# EAGLE design draft2 (EAGLE 6.2)
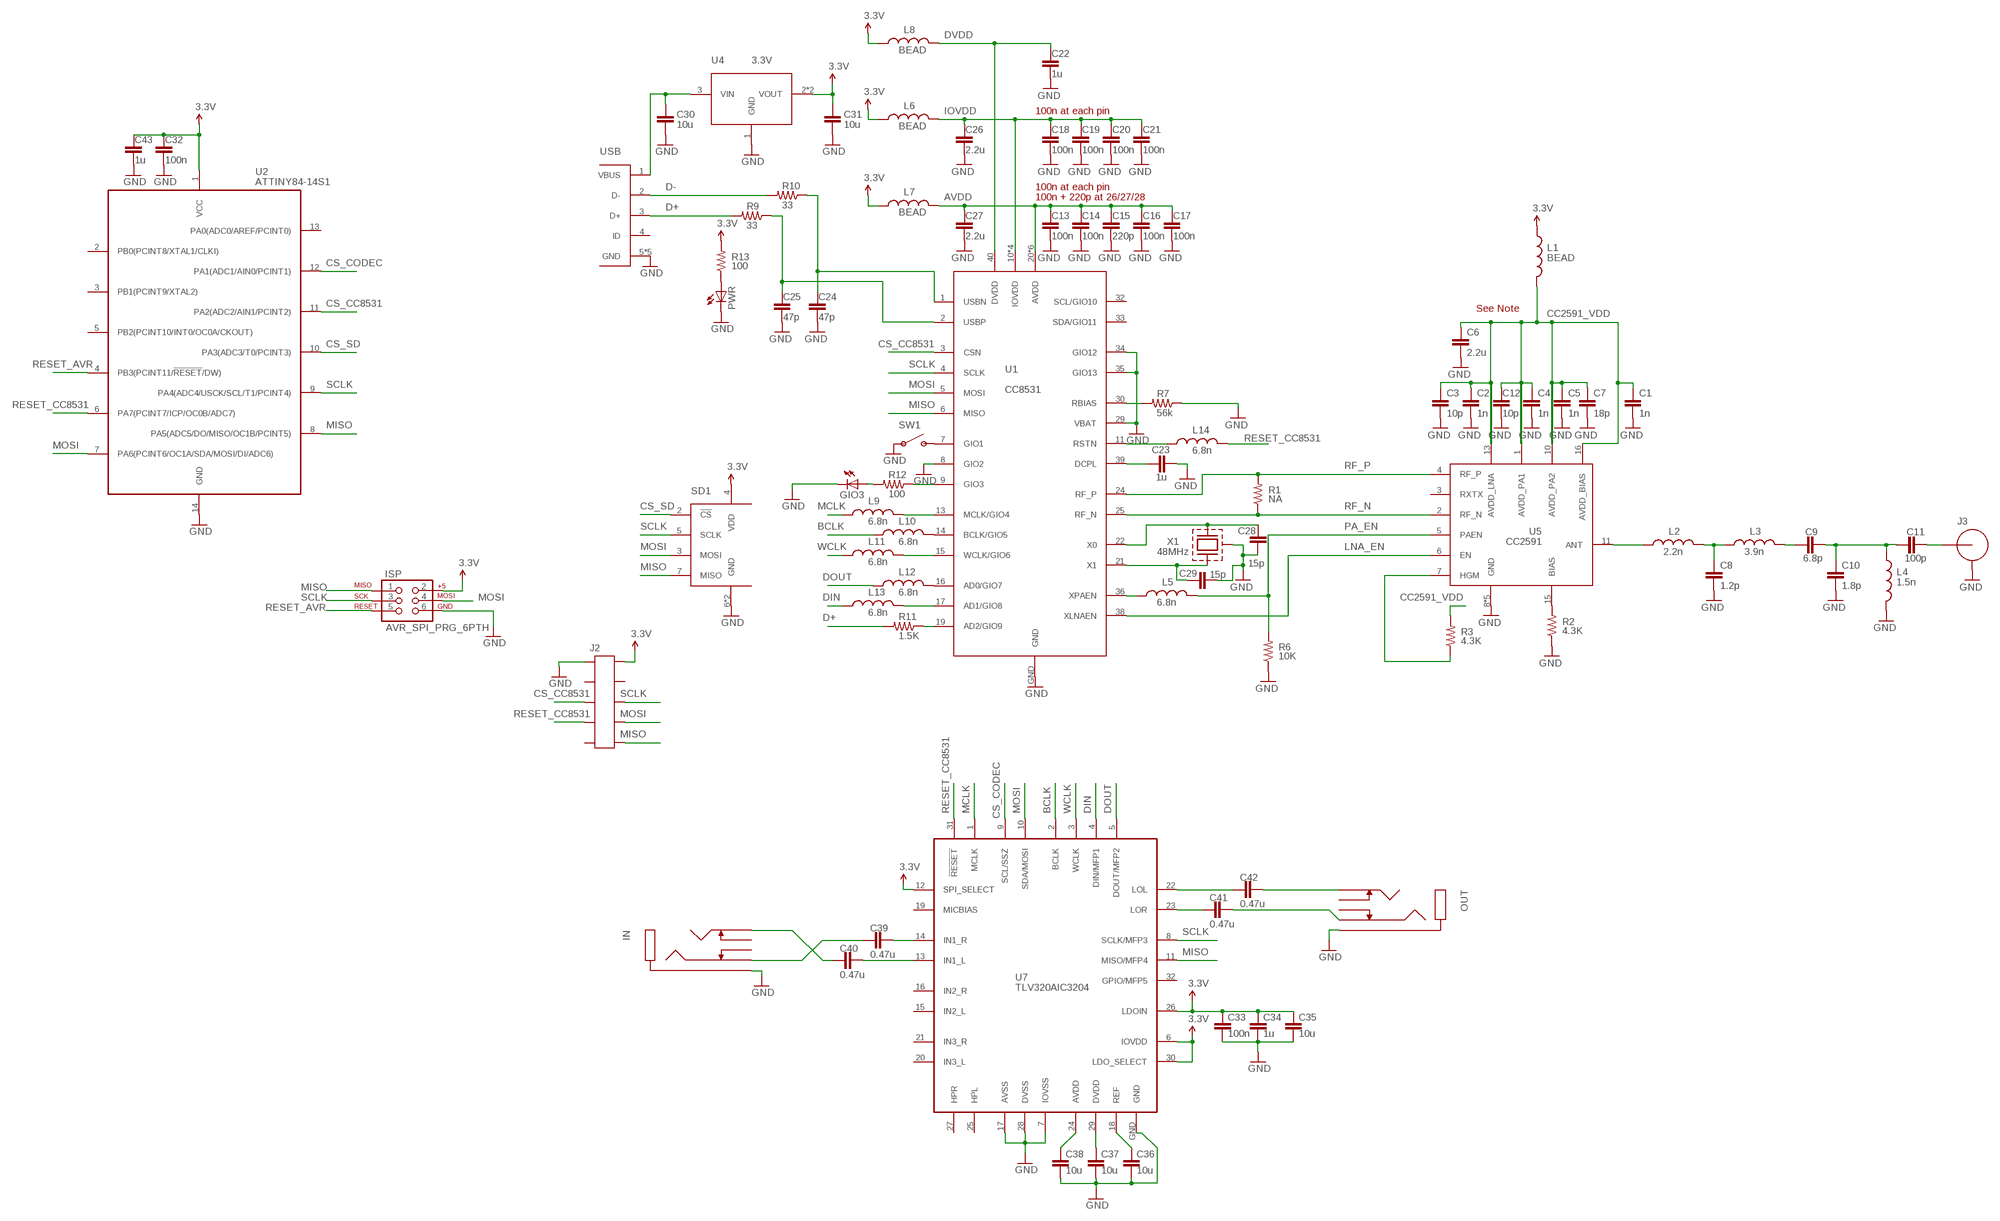
[diagram p0: schematic, sheet 1]

## Parts
C1  1n  C-EUC0603  [C0603]
C2  1n  C-EUC0603  [C0603]
C3  10p  C-EUC0603  [C0603]
C4  1n  C-EUC0603  [C0603]
C5  1n  C-EUC0603  [C0603]
C6  2.2u  C-EUC0603  [C0603]
C7  18p  C-EUC0603  [C0603]
C8  1.2p  C-EUC0603  [C0603]
C9  6.8p  C-EUC0603  [C0603]
C10  1.8p  C-EUC0603  [C0603]
C11  100p  C-EUC0603  [C0603]
C12  10p  C-EUC0603  [C0603]
C13  100n  C-EUC0603  [C0603]
C14  100n  C-EUC0603  [C0603]
C15  220p  C-EUC0603  [C0603]
C16  100n  C-EUC0603  [C0603]
C17  100n  C-EUC0603  [C0603]
C18  100n  C-EUC0603  [C0603]
C19  100n  C-EUC0603  [C0603]
C20  100n  C-EUC0603  [C0603]
C21  100n  C-EUC0603  [C0603]
C22  1u  C-EUC0603  [C0603]
C23  1u  C-EUC0603  [C0603]
C24  47p  C-EUC0603  [C0603]
C25  47p  C-EUC0603  [C0603]
C26  2.2u  C-EUC0603  [C0603]
C27  2.2u  C-EUC0603  [C0603]
C28  15p  C-EUC0603  [C0603]
C29  15p  C-EUC0603  [C0603]
C30  10u  C-EUC0603  [C0603]
C31  10u  C-EUC0603  [C0603]
C32  100n  C-EUC0603  [C0603]
C33  100n  C-EUC0603  [C0603]
C34  1u  C-EUC0603  [C0603]
C35  10u  C-EUC0603  [C0603]
C36  10u  C-EUC0603  [C0603]
C37  10u  C-EUC0603  [C0603]
C38  10u  C-EUC0603  [C0603]
C39  0.47u  C-EUC0603  [C0603]
C40  0.47u  C-EUC0603  [C0603]
C41  0.47u  C-EUC0603  [C0603]
C42  0.47u  C-EUC0603  [C0603]
C43  1u  C-EUC0603  [C0603]
GIO3  LEDCHIP-LED0603  [CHIP-LED0603]
IN  PHONE_SW  [35RAPC4BV4]
ISP  AVR_SPI_PRG_6PTH  [2X3]
J2  HEADER-10P-SMD-MALE  [10P-0.05-HEADER]
J3  SMA  [CONSMA003.031]
L1  BEAD  INDUCTOR0603  [0603]
L2  2.2n  INDUCTOR0603  [0603]
L3  3.9n  INDUCTOR0603  [0603]
L4  1.5n  INDUCTOR0603  [0603]
L5  6.8n  INDUCTOR0603  [0603]
L6  BEAD  INDUCTOR0603  [0603]
L7  BEAD  INDUCTOR0603  [0603]
L8  BEAD  INDUCTOR0603  [0603]
L9  6.8n  INDUCTOR0603  [0603]
L10  6.8n  INDUCTOR0603  [0603]
L11  6.8n  INDUCTOR0603  [0603]
L12  6.8n  INDUCTOR0603  [0603]
L13  6.8n  INDUCTOR0603  [0603]
L14  6.8n  INDUCTOR0603  [0603]
OUT  PHONE_SW  [35RAPC4BV4]
PWR  LEDCHIP-LED0603  [CHIP-LED0603]
R1  NA  R-US_R0603  [R0603]
R2  4.3K  R-US_R0603  [R0603]
R3  4.3K  R-US_R0603  [R0603]
R6  10K  R-US_R0603  [R0603]
R7  56k  R-US_R0603  [R0603]
R9  33  R-US_R0603  [R0603]
R10  33  R-US_R0603  [R0603]
R11  1.5K  R-US_R0603  [R0603]
R12  100  R-US_R0603  [R0603]
R13  100  R-US_R0603  [R0603]
SD1  MICROSDDM3AT  [DM3AT]
SW1  SPST-SMD  [TACT_SW]
U1  CC8531  [S-PVQFN-N40]
U2  ATTINY84-14S1  [SOIC14]
U4  3.3V  NX1117C  [SOT-223]
U5  CC2591  [S-PVQFN-N16]
U7  TLV320AIC3204  [S-PVQFN-N32]
USB  USB_MICRO_AB  [USB_MICRO_AB]
X1  48MHz  XTAL-ABRACONABM3C  [ABM3C]

## Nets
3.3V: C31.1 C32.1 C33.1 C34.1 C35.1 C43.1 ISP.2 J2.2 L1.1 L6.1 L7.1 L8.1 R13.2 SD1.4(VDD) U2.1(VCC) U4.2(VOUT) U4.4(VOUT) U7.6(IOVDD) U7.12(SPI_SELECT) U7.26(LDOIN) U7.30(LDO_SELECT)
AVDD: C13.1 C14.1 C15.1 C16.1 C17.1 C27.1 L7.2 U1.20(AVDD) U1.23(AVDD) U1.26(AVDD) U1.27(AVDD) U1.28(AVDD) U1.31(AVDD)
BCLK: L10.1 U7.2(BCLK)
CC2591_VDD: C1.1 C2.1 C3.1 C4.1 C5.1 C6.1 C7.1 C12.1 L1.2 R3.2 U5.1(AVDD_PA1) U5.10(AVDD_PA2) U5.13(AVDD_LNA) U5.16(AVDD_BIAS)
CS_CC8531: J2.5 U1.3(CSN) U2.11(PA2(ADC2/AIN1/PCINT2))
CS_CODEC: U2.12(PA1(ADC1/AIN0/PCINT1)) U7.9(SCL/SSZ)
CS_SD: SD1.2(!CS) U2.10(PA3(ADC3/T0/PCINT3))
D+: R9.2 R11.2 USB.3(D+)
D-: R10.2 USB.2(D-)
DIN: L13.1 U7.4(DIN/MFP1)
DOUT: L12.1 U7.5(DOUT/MFP2)
DVDD: C22.1 L8.2 U1.40(DVDD)
GND: C1.2 C2.2 C3.2 C4.2 C5.2 C6.2 C7.2 C8.2 C10.2 C12.2 C13.2 C14.2 C15.2 C16.2 C17.2 C18.2 C19.2 C20.2 C21.2 C22.2 C23.2 C24.2 C25.2 C26.2 C27.2 C28.2 C29.2 C30.2 C31.2 C32.2 C33.2 C34.2 C35.2 C36.2 C37.2 C38.2 C43.2 GIO3.C IN.1(GND) ISP.6 J2.1 J3.GND1(GND) J3.GND2(GND) J3.GND3(GND) J3.GND4(GND) L4.2 OUT.1(GND) PWR.C R2.1 R6.1 R7.1 SD1.6(GND) SD1.GND SW1.1 SW1.2 U1.8(GIO2) U1.29(VBAT) U1.34(GIO12) U1.35(GIO13) U1.GND U2.14(GND) U4.1(GND) U5.8(GND) U5.9(GND) U5.12(GND) U5.14(GND) U5.GND U7.7(IOVSS) U7.17(AVSS) U7.28(DVSS) U7.GND USB.5(GND) USB.GND1(GND) USB.GND2(GND) USB.GND3(GND) USB.GND4(GND) X1.2(CASE) X1.4(CASE)
IOVDD: C18.1 C19.1 C20.1 C21.1 C26.1 L6.2 U1.10(IOVDD) U1.12(IOVDD) U1.18(IOVDD) U1.37(IOVDD)
IOVDD1: C24.1 R10.1 U1.1(USBN)
IOVDD2: C25.1 R9.1 U1.2(USBP)
LNA_EN: U1.38(XLNAEN) U5.6(EN)
MCLK: L9.1 U7.1(MCLK)
MISO: ISP.1 J2.10 SD1.7(MISO) U1.6(MISO) U2.8(PA5(ADC5/DO/MISO/OC1B/PCINT5)) U7.11(MISO/MFP4)
MOSI: ISP.4 J2.8 SD1.3(MOSI) U1.5(MOSI) U2.7(PA6(PCINT6/OC1A/SDA/MOSI/DI/ADC6)) U7.10(SDA/MOSI)
N$1: C29.1 U1.21(X1) X1.1
N$2: C28.1 U1.22(X0) X1.3
N$3: L14.1 U1.11(RSTN)
N$6: C30.1 U4.3(VIN) USB.1(VBUS)
N$7: R2.2 U5.15(BIAS)
N$8: R3.1 U5.7(HGM)
N$9: C11.2 J3.SIG
N$12: C38.1 U7.24(AVDD)
N$13: L2.1 U5.11(ANT)
N$14: C8.1 L2.2 L3.1
N$15: C9.1 L3.2
N$16: C9.2 C10.1 C11.1 L4.1
N$18: L5.1 U1.36(XPAEN)
N$19: R7.2 U1.30(RBIAS)
N$20: C36.1 U7.18(REF)
N$21: C23.1 U1.39(DCPL)
N$22: L10.2 U1.14(BCLK/GIO5)
N$23: L9.2 U1.13(MCLK/GIO4)
N$24: R11.1 U1.19(AD2/GIO9)
N$25: L11.2 U1.15(WCLK/GIO6)
N$26: L12.2 U1.16(AD0/GIO7)
N$27: L13.2 U1.17(AD1/GIO8)
N$28: R12.1 U1.9(GIO3)
N$29: GIO3.A R12.2
N$30: SW1.3 SW1.4 U1.7(GIO1)
N$31: PWR.A R13.1
N$32: C37.1 U7.29(DVDD)
N$33: C40.1 IN.2(L)
N$34: C39.2 U7.14(IN1_R)
N$35: C40.2 U7.13(IN1_L)
N$36: C39.1 IN.4(R)
N$37: C42.2 OUT.2(L)
N$38: C41.2 OUT.4(R)
N$39: C42.1 U7.22(LOL)
N$40: C41.1 U7.23(LOR)
PA_EN: L5.2 R6.2 U5.5(PAEN)
RESET_AVR: ISP.5 U2.4(PB3(PCINT11/!RESET!/DW))
RESET_CC8531: J2.7 L14.2 U2.6(PA7(PCINT7/ICP/OC0B/ADC7)) U7.31(!RESET)
RF_N: R1.1 U1.25(RF_N) U5.2(RF_N)
RF_P: R1.2 U1.24(RF_P) U5.4(RF_P)
SCLK: ISP.3 J2.6 SD1.5(SCLK) U1.4(SCLK) U2.9(PA4(ADC4/USCK/SCL/T1/PCINT4)) U7.8(SCLK/MFP3)
WCLK: L11.1 U7.3(WCLK)
Unconnected: IN.3(R_SW) IN.5(L_SW) J2.3 J2.4 J2.9 OUT.3(R_SW) OUT.5(L_SW) U1.32(SCL/GIO10) U1.33(SDA/GIO11) U2.2(PB0(PCINT8/XTAL1/CLKI)) U2.3(PB1(PCINT9/XTAL2)) U2.5(PB2(PCINT10/INT0/OC0A/CKOUT)) U2.13(PA0(ADC0/AREF/PCINT0)) U5.3(RXTX) U7.15(IN2_L) U7.16(IN2_R) U7.19(MICBIAS) U7.20(IN3_L) U7.21(IN3_R) U7.25(HPL) U7.27(HPR) U7.32(GPIO/MFP5) USB.4(ID)

## Notes on the sheet
- 100n at each pin
- 100n at each pin
- 100n + 220p at 26/27/28
- See Note

## Library data of the parts
C1-C43 = rcl:C-EU: CAPACITOR, European symbol
GIO3 PWR = led:LED: LED OSRAM: - CHIPLED LG R971, LG N971, LY N971, LG Q971, LY Q971, LO R971, LY R971 LH N974, LH R974 LS Q976, LO Q976, LY Q976 LO Q996 - Hyper CHIPLED LW Q18S LB Q993, LB Q99A, LB R99A - SideLED LS A670, LO A670, LY A670, LG A670, LP A670 LB A673, LV A673, LT A673, LW A673 LH A674 LY A675 LS A676, LA A676, LO A676, LY A676, LW A676 LS A679, LY A679, LG A679 - Hyper Micro SIDELED® LS Y876, LA Y876, LO Y876, LY Y876 LT Y87S - SmartLED LW L88C, LW L88S LB L89C, LB L89S, LG L890 LS L89K, LO L89K, LY L89K LS L896, LA L896, LO L896, LY L896 - TOPLED LS T670, LO T670, LY T670, LG T670, LP T670 LSG T670, LSP T670, LSY T670, LOP T670, LYG T670 LG T671, LOG T671, LSG T671 LB T673, LV T673, LT T673, LW T673 LH T674 LS T676, LA T676, LO T676, LY T676, LB T676, LH T676, LSB T676, LW T676 LB T67C, LV T67C, LT T67C, LS T67K, LO T67K, LY T67K, LW E67C LS E67B, LA E67B, LO E67B, LY E67B, LB E67C, LV E67C, LT E67C LW T67C LS T679, LY T679, LG T679 LS T770, LO T770, LY T770, LG T770, LP T770 LB T773, LV T773, LT T773, LW T773 LH T774 LS E675, LA E675, LY E675, LS T675 LS T776, LA T776, LO T776, LY T776, LB T776 LHGB T686 LT T68C, LB T68C - Hyper Mini TOPLED® LB M676 - Mini TOPLED Santana® LG M470 LS M47K, LO M47K, LY M47K Source: http://www.osram.convergy.de LUXEON: - LUMILED® LXK2-PW12-R00, LXK2-PW12-S00, LXK2-PW14-U00, LXK2-PW14-V00 LXK2-PM12-R00, LXK2-PM12-S00, LXK2-PM14-U00 LXK2-PE12-Q00, LXK2-PE12-R00, LXK2-PE12-S00, LXK2-PE14-T00, LXK2-PE14-U00 LXK2-PB12-K00, LXK2-PB12-L00, LXK2-PB12-M00, LXK2-PB14-N00, LXK2-PB14-P00, LXK2-PB14-Q00 LXK2-PR12-L00, LXK2-PR12-M00, LXK2-PR14-Q00, LXK2-PR14-R00 LXK2-PD12-Q00, LXK2-PD12-R00, LXK2-PD12-S00 LXK2-PH12-R00, LXK2-PH12-S00 LXK2-PL12-P00, LXK2-PL12-Q00, LXK2-PL12-R00 Source: www.luxeon.com KINGBRIGHT: KA-3528ASYC Source: www.kingbright.com
IN OUT = 00-EvaLibrary:PHONE_SW
ISP = SparkFun-Connectors:AVR_SPI_PRG_6: AVR ISP 6 Pin This is the reduced ISP connector for AVR programming. Common on Arduino. This footprint will take up less PCB space and can be used with a 10-pin to 6-pin adapter such as SKU: BOB-08508
J2 = 00-EvaLibrary:HEADER-10P
J3 = 00-EvaLibrary:SMA
L1-L14 = SparkFun:INDUCTOR: Inductors Basic Inductor/Choke - 0603 and 1206. Footprints are not proven and vary greatly between part numbers.
R1-R3 R6 R7 R9-R13 = rcl:R-US_: RESISTOR, American symbol
SD1 = 00-EvaLibrary:MICROSD
SW1 = 00-EvaLibrary:SPST
U1 = 00-EvaLibrary:CC8531
U2 = 00-EvaLibrary:ATTINY84
U4 = 00-EvaLibrary:NX1117C
U5 = 00-EvaLibrary:CC2591
U7 = 00-EvaLibrary:TLV320AIC3204
USB = 00-EvaLibrary:USB_MICRO_AB
X1 = 00-EvaLibrary:XTAL-ABRACON

## Board
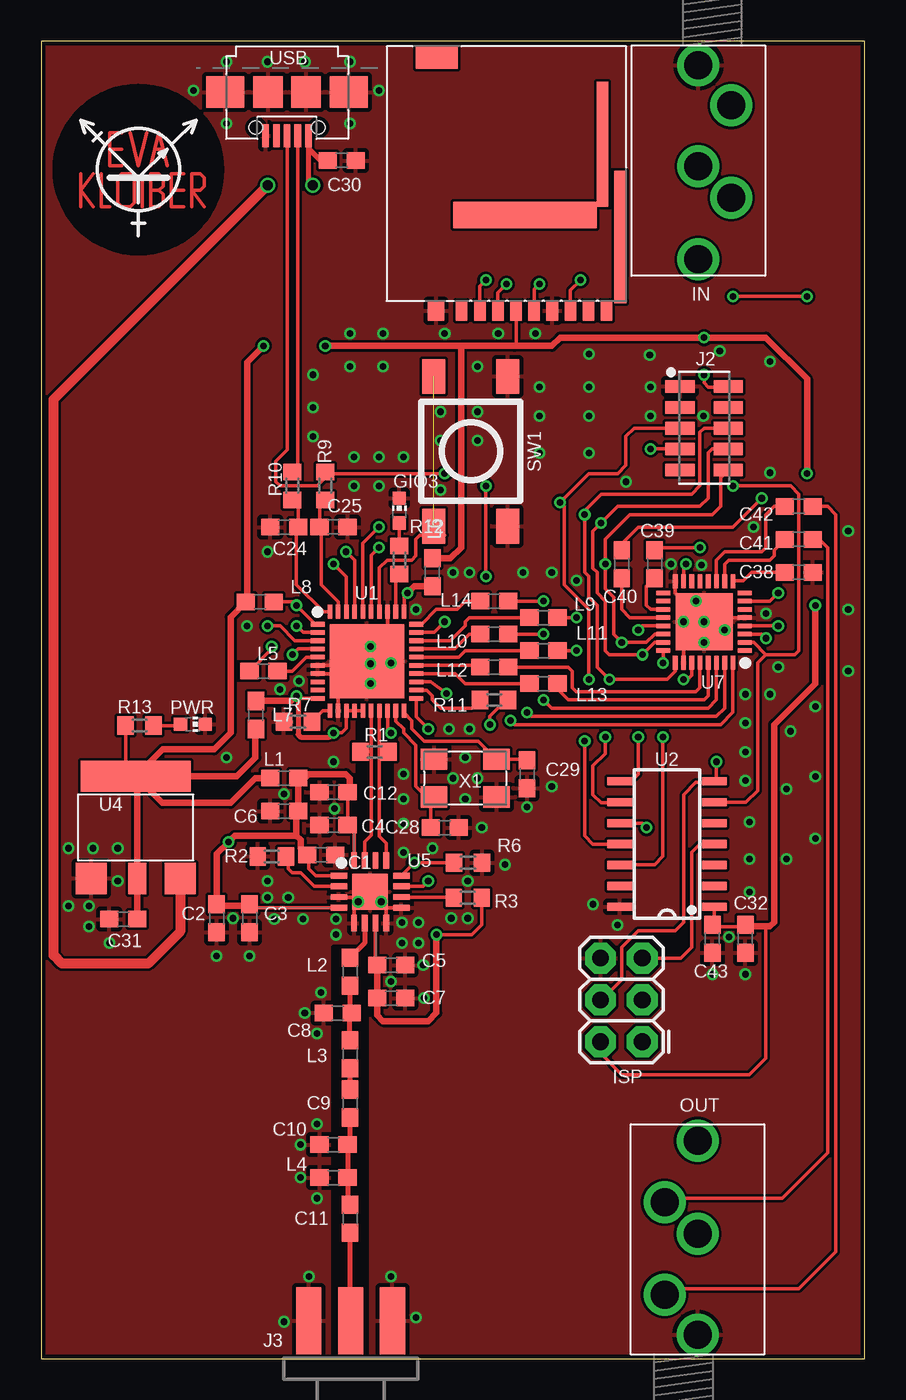
[diagram p1: board, top side]
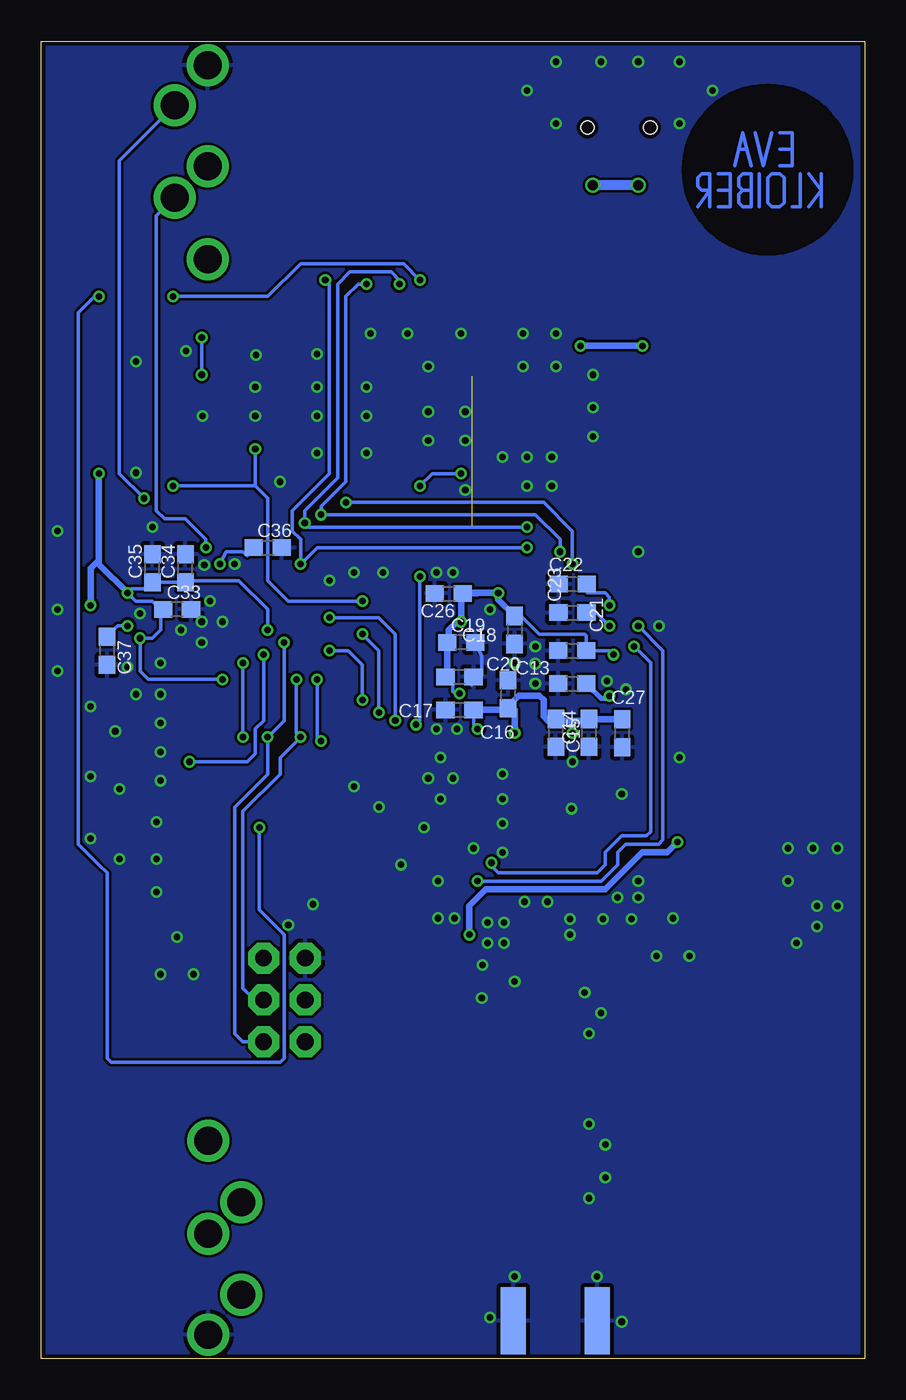
[diagram p2: board, bottom side, seen from below]

Size 50 x 80 mm. Coordinates in mm from the lower left corner, seen from the top.
Outline: 0,0 50,0 50,80 0,80 0,0
Copper layers (1*16): Top 0.035mm / dielectric 1.5mm / Bottom 0.035mm
Design rules: minimum track width 6mil, minimum drill 12mil, track to track 6mil, track to pad 6mil, pad to pad 6mil, via to via 6mil, smd to smd 0mil, copper to edge 10mil, drill to drill 10mil, minimum pad ring 10mil, minimum via ring 6mil, stop-mask expansion 2mil, vias tented up to drill 100mil, thermal gap 10mil
tRestrict: area 17.8,0.2 to 19.8,25; area 19.2,29.8 to 21.2,39.8

### Footprints (pad centres in the part's own frame; a part is rotated, then mirrored left to right if it is on the bottom)
C0603 = smd 1.1 x 1: 1 -0.85,0; 2 0.85,0
CHIP-LED0603 = smd 0.8 x 0.8: A 0,-0.75; C 0,0.75
35RAPC4BV4 = drill 1.7 pad 2.4: 1 1.2,-0.85; 2 3.65,1.15; 3 7.35,-0.85; 4 9.25,1.15; 5 13,-0.85
2X3 = drill 1.016 pad 1.88 octagon: 1 0,0; 2 0,2.54; 3 2.54,0; 4 2.54,2.54; 5 5.08,0; 6 5.08,2.54
10P-0.05-HEADER = smd 1.778 x 0.762: 1 -1.46,2.54; 2 1.46,2.54; 3 -1.46,1.27; 4 1.46,1.27; 5 -1.46,0; 6 1.46,0; 7 -1.46,-1.27; 8 1.46,-1.27; 9 -1.46,-2.54; 10 1.46,-2.54
CONSMA003.031 = smd 4.064 x 1.524: GND1 0,2.54; GND2 0,-2.54; SIG 0,0 | smd 4.064 x 1.524 bottom: GND3 0,2.54; GND4 0,-2.54
0603 = smd 1.1 x 1: 1 -0.85,0; 2 0.85,0
R0603 = smd 1 x 1.1: 1 -0.85,0; 2 0.85,0
DM3AT = smd 0.7 x 1.2: 1 0,0.6; 2 -1.1,0.6; 3 -2.2,0.6; 4 -3.3,0.6; 5 -4.4,0.6; 6 -5.5,0.6; 7 -6.6,0.6; 8 -7.7,0.6; SW -8.8,0.6 | smd 1 x 1.2: GND 1.55,0.6 | smd 8.7 x 1.6: NC1 -3.85,-5.2 | smd 0.7 x 7.6: NC2 -8.55,-9.5 | smd 0.75 x 8.05: NC3 -9.625,-3.875 | smd 2.55 x 1.35: NC4 1.5,-14.775
TACT_SW = smd 1.4 x 2.1: 1 2.25,4.55; 2 2.25,-4.55; 3 -2.25,4.55; 4 -2.25,-4.55
S-PVQFN-N40 = smd 0.28 x 0.85: 1 -2.25,3; 2 -1.75,3; 3 -1.25,3; 4 -0.75,3; 5 -0.25,3; 6 0.25,3; 7 0.75,3; 8 1.25,3; 9 1.75,3; 10 2.25,3; 21 2.25,-3; 22 1.75,-3; 23 1.25,-3; 24 0.75,-3; 25 0.25,-3; 26 -0.25,-3; 27 -0.75,-3; 28 -1.25,-3; 29 -1.75,-3; 30 -2.25,-3 | smd 0.85 x 0.28: 11 3,2.25; 12 3,1.75; 13 3,1.25; 14 3,0.75; 15 3,0.25; 16 3,-0.25; 17 3,-0.75; 18 3,-1.25; 19 3,-1.75; 20 3,-2.25; 31 -3,-2.25; 32 -3,-1.75; 33 -3,-1.25; 34 -3,-0.75; 35 -3,-0.25; 36 -3,0.25; 37 -3,0.75; 38 -3,1.25; 39 -3,1.75; 40 -3,2.25 | smd 4.5 x 4.5: GND 0,0
SOIC14 = smd 0.5 x 1.5: 1 3.81,2.875; 2 2.54,2.875; 3 1.27,2.875; 4 0,2.875; 5 -1.27,2.875; 6 -2.54,2.875; 7 -3.81,2.875; 8 -3.81,-2.875; 9 -2.54,-2.875; 10 -1.27,-2.875; 11 0,-2.875; 12 1.27,-2.875; 13 2.54,-2.875; 14 3.81,-2.875
SOT-223 = smd 1.9 x 1.9: 1 -2.7,-3.1; 3 2.7,-3.1 | smd 1.1 x 1.9: 2 0.1,-3.1 | smd 6.7 x 1.9: 4 0,3.1
S-PVQFN-N16 = smd 0.35 x 1: 1 -0.975,1.9; 2 -0.325,1.9; 3 0.325,1.9; 4 0.975,1.9; 9 0.975,-1.9; 10 0.325,-1.9; 11 -0.325,-1.9; 12 -0.975,-1.9 | smd 1 x 0.35: 5 1.9,0.975; 6 1.9,0.325; 7 1.9,-0.325; 8 1.9,-0.975; 13 -1.9,-0.975; 14 -1.9,-0.325; 15 -1.9,0.325; 16 -1.9,0.975 | smd 2.16 x 2.16: GND 0,0
S-PVQFN-N32 = smd 0.28 x 0.85: 1 -1.75,2.475; 2 -1.25,2.475; 3 -0.75,2.475; 4 -0.25,2.475; 5 0.25,2.475; 6 0.75,2.475; 7 1.25,2.475; 8 1.75,2.475; 17 1.75,-2.475; 18 1.25,-2.475; 19 0.75,-2.475; 20 0.25,-2.475; 21 -0.25,-2.475; 22 -0.75,-2.475; 23 -1.25,-2.475; 24 -1.75,-2.475 | smd 0.85 x 0.28: 9 2.475,1.75; 10 2.475,1.25; 11 2.475,0.75; 12 2.475,0.25; 13 2.475,-0.25; 14 2.475,-0.75; 15 2.475,-1.25; 16 2.475,-1.75; 25 -2.475,-1.75; 26 -2.475,-1.25; 27 -2.475,-0.75; 28 -2.475,-0.25; 29 -2.475,0.25; 30 -2.475,0.75; 31 -2.475,1.25; 32 -2.475,1.75 | smd 3.45 x 3.45: GND 0,0
USB_MICRO_AB = smd 0.4 x 1.4: 1 -1.3,2.65; 2 -0.65,2.65; 3 0,2.65; 4 0.65,2.65; 5 1.3,2.65 | smd 2.3 x 1.9: GND1 -3.75,0; GND4 3.75,0 | smd 1.8 x 1.9: GND2 -1.15,0; GND3 1.15,0 | hole 0.8: 1.9,2.15; -1.9,2.15
ABM3C = smd 1.6 x 1.3: 1 -1.9,-1.15; 2 1.9,-1.15; 3 1.9,1.15; 4 -1.9,1.15

### Placement (x,y rotation side)
C1  17,30.6 0 top
C2  10.65,26.75 270 top
C3  12.65,26.75 270 top
C4  17.75,32.4 180 top
C5  21.25,23.9 0 top
C6  14.75,33.25 180 top
C7  21.25,21.9 0 top
C8  18,21 180 top
C9  18.75,15.5 270 top
C10  17.75,13 180 top
C11  18.75,8.5 270 top
C12  17.75,34.4 180 top
C13  17.75,41 180 bottom
C14  16.75,38 270 bottom
C15  18.75,38 270 bottom
C16  21.65,40.35 90 bottom
C17  24.6,39.4 180 bottom
C18  21.25,44.25 270 bottom
C19  24.5,43.5 0 bottom
C20  24.6,41.4 0 bottom
C21  17.75,43 180 bottom
C22  17.73,47.03 180 bottom
C23  17.74,45.3 180 bottom
C24  14.75,50.5 180 top
C25  17.75,50.5 0 top
C26  25.26,46.47 180 bottom
C27  14.72,37.97 270 bottom
C28  24.5,32.25 0 top
C29  29.5,35.5 270 top
C30  18.25,72.75 0 top
C31  4.99,26.7 180 top
C32  42.75,25.5 270 top
C33  41.75,45.5 0 bottom
C34  41.25,48 90 bottom
C35  43.25,48 90 bottom
C36  36.25,49.25 0 bottom
C37  46,43 270 bottom
C38  46,47.75 0 top
C39  37.25,48.25 270 top
C40  35.25,48.25 270 top
C41  46,49.75 0 top
C42  46,51.75 0 top
C43  40.75,25.5 270 top
GIO3  21.75,51.5 0 top
IN  40.75,79.75 270 top
ISP  36.5,19.25 90 top
J2  40.25,56.5 0 top
J3  18.79,2.32 90 top
L1  14.75,35.25 0 top
L2  18.75,23.5 270 top
L3  18.75,18.5 270 top
L4  17.75,11 180 top
L5  13.5,41.75 180 top
L6  23.75,47.75 270 top
L7  13.04,39.09 90 top
L8  13.28,45.96 0 top
L9  30.5,45 180 top
L10  27.5,44 180 top
L11  30.5,43 180 top
L12  27.5,42 180 top
L13  30.5,41 180 top
L14  27.5,46 0 top
OUT  39,0.25 90 top
PWR  9.21,38.52 270 top
R1  20.25,36.85 0 top
R2  14,30.5 0 top
R3  25.9,28 0 top
R6  25.92,30.12 180 top
R7  15.59,38.68 0 top
R9  17.25,53 90 top
R10  15.25,53 90 top
R11  27.5,40 0 top
R12  21.75,48.5 90 top
R13  5.98,38.45 180 top
SD1  25.53,64.24 180 top
SW1  26.09,55.1 0 top
U1  19.78,42.35 0 top
U2  38,31.25 270 top
U4  5.74,32.27 0 top
U5  19.97,28.36 0 top
U7  40.25,44.75 180 top
U$1  [TRANS]  5.9,72.2 0 top
USB  14.93,76.91 180 top
X1  25.75,35.25 180 top

### Tracks (layer width: path | path; a pad name or v marks a point on that pad's centre or on a via)
3.3V  (via drill 0.4)
  Top 0.2: U7.30 43.75,44 v44,43.75 | U7.12 36.5,44.5 v36.25,44.25 | U7.6 39.5,41.5 39.25,41.25 v39,41.25 | U7.26 44.25,46 v44.75,46.5 | v40.25,59.75 40.25,59.25 40.5,59 41.67,59 J2.2 | 29.91,61.58 29.96,61.48 30.98,61.48 31,61.5 | R13.2 5.13,35.98 U4.4 | U2.1 40.88,26.48 C43.1 | 40.88,26.23 42.62,26.23 C32.1 42.75,26.25 | ISP.2 33.96,18.54 35.25,17.25 43,17.25 44,18.25 44,26.25 | SD1.4 28.83,61.58 28.75,61.5
  Top 0.3: 12.5,46.03 L8.1
  Top 0.4: L8.1 11.5,45.03 11.5,38 10.5,37 7.37,37 U4.4 | L6.1 24.85,48.6 25.5,49.25 25.5,61.5 | 25.5,61.5 28.75,61.5 31,61.5 31.5,62 v40.25,62 44,62 46.5,59.5 v46.5,53.75 | U4.4 11.87,35.37 13,36.5 13,38.2 L7.1 | L1.1 13,35.25 11.5,33.75 7.36,33.75 U4.4 | C31.1 U4.2 5.84,35.27 U4.4 | 12.5,46.03 12.5,60.5 v13.5,61.5 | v17.25,61.5 25.5,61.5 | 40.88,26.23 C43.1 | 42.75,26.25 44,26.25 44.25,26.25 44.5,26.5 44.5,38.5 47,41 v47,45.75
  Bottom 0.2: v36.25,44.25 36.25,45.5 38,47.25 41.15,47.25 C34.1 C35.1 43.65,46.75 44.5,46.75 v44.75,46.5 44.25,46 43.25,46 42.75,45.5 C33.1 42.75,45.35 42.75,44.25 43.25,43.75 v44,43.75 44,41.75 43.5,41.25 v39,41.25 | v40.25,62 v40.25,59.75
  Bottom 0.4: v13.5,61.5 v17.25,61.5 | v46.5,53.75 46.5,48.5 | 46.5,48.5 46.5,48.25 v44.75,46.5 | v47,45.75 47,48 46.5,48.5
AVDD  (via drill 0.4)
  Top 0.2: U1.23 21.03,38.22 v21.25,38 | U1.20 22.78,38.97 v23.5,38.25 | v17.75,38 18.25,38 18.53,38.28 U1.28 U1.27 U1.26 | U1.31 15.65,40.1 | v15.5,40.25 15.5,40.2 15.6,40.1
  Top 0.3: 15.65,40.1 v15.5,40.25 | 15.6,40.1 15.6,37.9 15.75,37.75 17.5,37.75 v17.75,38
  Top 0.4: L7.2 15.19,39.94 v15.5,40.25
  Bottom 0.2: 21.25,39.4 C16.1 21.65,39.6 | 16.85,38.75 C14.1 | 18.65,38.75 C15.1 18.75,38.75 | C17.1 23.75,38.5 v23.5,38.25
  Bottom 0.3: C13.1 16,40.1 15.65,40.1 v15.5,40.25
  Bottom 0.4: v21.25,38 21.25,39.4 | v17.75,38 17.75,38.75 | 17.75,38.75 16.85,38.75 | 18.65,38.75 17.75,38.75 | 21.65,39.6 21,40.25 19.75,40.25 19.5,40 19.5,39 19.25,38.75 18.75,38.75 | C27.1 16.72,38.82 C14.1 | C17.1 21.75,39.4 C16.1
BCLK  (via drill 0.4)
  Top 0.2: U7.2 41.5,39.5 41,39 29.75,39 v29.5,39.25 | v30.5,44 L10.1
  Bottom 0.2: v29.5,39.25 29.5,43 v30.5,44
CC2591_VDD  (via drill 0.4)
  Top 0.2: U5.1 19,32.01 C4.1 C12.1 | C5.1 20.3,24 U5.10 20.3,23.95 20.5,23.75 | 17.91,29.34 U5.16 16.66,29.34 16.25,29.75 16.25,30.5 C1.1 | U5.13 12.87,27.39 C3.1 | 10.75,27.5 C2.1 | R3.2 26.75,26.35 26.15,25.75 24.25,25.75 24,25.5
  Top 0.4: C12.1 18.75,34.55 18.75,35.25 18.5,35.5 16.25,35.5 16,35.25 L1.2 C6.1 15.5,33.15 15.5,31.75 | 15.5,31.75 15.75,31.5 15.75,31 C1.1 | C2.1 10.65,30.65 v11.38,31.38 11.75,31.75 15.5,31.75 | v24,25.75 24,25.5 24,21 23.5,20.5 20.75,20.5 20.4,20.85 C7.1 C5.1 | 10.75,27.5 12.55,27.5 C3.1
  Bottom 0.4: v24,25.75 24,27.5 23,28.5 15.75,28.5 13.5,30.75 12,30.75 v11.38,31.38
CS_CC8531  (via drill 0.4)
  Top 0.2: U1.3 18.53,47.47 v17.75,48.25 | J2.5 36,56.5 35.5,56 35.5,54.25 35,53.75 33.25,53.75 v31.5,52 31.75,51.75 31.75,47 33.25,45.5 v33.25,41.25 | v33,37.5 33,31.75 33.5,31.25 U2.11
  Bottom 0.2: v17.75,48.25 17.75,50.25 19.5,52 v31.5,52 | v33.25,41.25 33.25,37.75 v33,37.5
CS_CODEC  (via drill 0.4)
  Top 0.2: U7.9 37.77,42.27 v37.75,42.25 | v37.75,37.75 37.75,30.5 37.25,30 35.15,30 U2.12
  Bottom 0.2: v37.75,42.25 v37.75,37.75
CS_SD  (via drill 0.4)
  Top 0.2: SD1.2 26.63,65.13 v27,65.5 | v42,64.5 v46.5,64.5 | U2.10 36.48,32.52 v36.75,32.25
  Bottom 0.2: v27,65.5 28,66.5 34.25,66.5 36.25,64.5 v42,64.5 | v46.5,64.5 46.75,64.5 47.75,63.5 47.75,31.25 46.62,30.12 46.5,30 46,29.5 46,18.25 45.75,18 35.5,18 35.25,18.25 35.25,25.75 36.75,27.25 v36.75,32.25
D+  (via drill 0.4)
  Top 0.2: R11.2 28.25,40 27.25,39 v27.25,38.5 | v27,53 v27,47.5 | v24.5,53.75 17.35,53.75 R9.2 17.25,53.5 16.75,53 14.5,53 14.25,53.25 14.25,54.5 14.93,55.18 USB.3
  Bottom 0.2: v27,47.5 27,38.75 v27.25,38.5 | v27,53 26.25,53.75 v24.5,53.75
D-
  Top 0.2: 15.33,53.93 R10.2 15.58,54.18 USB.2
DIN
  Top 0.2: U7.4 40.5,40.25 40.25,40 32,40 31.5,40.5 31.5,40.85 L13.1
DOUT
  Top 0.2: U7.5 40,40.75 39.75,40.5 32.5,40.5 32.25,40.75 32.25,41.75 32,42 L12.1
DVDD  (via drill 0.4)
  Top 0.2: U1.40 16.65,44.6 v15.5,45.75 15.29,45.96 L8.2
  Bottom 0.2: v15.5,45.75 15.5,46.25 15.75,46.5 16.85,46.5 C22.1
GND  (via drill 0.4)
  Top 0.2: U1.35 19.53,42.1 U1.GND | U1.34 19.03,41.6 | 19.03,41.6 U1.GND | U1.8 21.03,43.6 U1.GND | U7.7 39,43.5 U7.GND | U7.17 38.5,46.5 U7.GND | U7.28 40.5,45 U7.GND | U5.9 20.95,27.39 | U5.14 19.64,28.04 U5.GND | U5.8 20.95,27.39 | 20.95,27.39 U5.GND | U5.12 19,27.39 U5.GND | U1.29 18.03,40.6 19.03,41.6
  Bottom 0.2: 23.85,40.9 23.25,41.5 23.25,42.65 C19.2
  other vias: 42.75,42.25 49,45.5 24.75,38.25 26,38.25 11.25,36.5 37,59 14.5,40.65 17.75,36.25 17.8,33.4 14.75,34.3 14.15,26.7 15.9,26.7 17.9,26.7 12.65,24.45 10.65,24.45 11.65,26.75 21.9,25.25 23.2,23.9 21.25,22.9 23.25,21.9 16,21 17,22.25 16.75,19.75 16.75,14.25 15.75,13 15.75,11 16.75,9.75 21.25,5 22.75,2.5 14.75,2.25 16.25,5 44,45.25 44.75,42 38.25,48.25 43.25,50.5 49,41.75 31,47.75 29.25,47.75 26,47.75 12.5,44.5 13.75,49 19,53 22,35.5 22,34 22,32.5 25.75,36.5 25,35.25 26.5,35.25 25.75,34 26.75,32.25 29.5,33.5 31,34.75 23.75,31 25.9,29 21.9,26.5 22.9,26.5 22.9,25.25 17.9,25.75 13.75,29 13.75,28 15,28 22,30.75 49,50.25 36.95,60.95 41.2,61.2 44.25,60.55 44.25,53.8 20.5,53 22.75,45.5 20,43.25 21.25,42.25 20,41 40.25,44.75 40.25,43.5 39,44.75 41.5,44.25 39.75,46 19.25,27.75 20.65,27.75 20,42.2 15.65,41.15 25,47.75 40.1,48.2 16.5,59.75 16.5,57.75 16.5,56 19,54.75 20.5,54.75 22,54.75 24.25,55.75 24.25,57.5 18.75,60.25 20.75,60.25 30.25,59 30,62.25 27.75,62.25 24.5,62.25 20.75,62.25 18.75,62.25 26.5,57.5 26.5,55.75 24.25,52.75 37,57.25 33.25,55 33.25,57.25 33.25,59 33.25,61 30.25,57.25 30.25,55 26.5,60.25 32.5,47.25 35.5,53.25 40.2,57.25 25.9,26.75 24.9,26.75 28.15,30 2.9,26.25 4.15,25.25 4.65,29 2.9,27.5 3.15,31 4.65,31 1.65,31 1.65,27.5 11.25,78.75 13.75,78.75 16,78.75 18.75,78.75 18.75,75 11.25,75 9.25,77 20.5,77 41.75,25.6 40.75,23.35 42.75,23.35 33.5,27.6 35,26.35 43,32.6 43,30.35 43,28.35 42.75,40.35 42.75,38.6 42.75,36.85 42.75,35.1 44.25,40.35 45.5,38.1 47,39.6 45.25,34.6 47,35.35 45.25,30.35 47,31.6
  pour Top (isolate 0.16): 0,80 50,80 50,0 0,0
  pour Bottom (isolate 0.16): 0,80 50,80 50,0 0,0
IOVDD  (via drill 0.4)
  Top 0.2: U1.37 15.6,43.1 v15.25,42.75 | U1.10 22.03,46.28 v22.25,46.5 | v24.5,44.75 23.85,44.1 U1.12 | U1.18 23.65,41.1 v24.6,40.4
  Top 0.4: L6.2 22.65,46.9 v22.25,46.5
  Bottom 0.2: 20.85,45.1 C18.1 21.15,45 20.75,45 19.75,44 17,44 16.9,43.9 C21.1 15.5,43 v15.25,42.75 | v24.6,40.4 24.9,40.4 25,40.5 25,41.35 C20.1
  Bottom 0.4: C18.1 22.25,46.1 v22.25,46.5 23.5,46.5 | 23.5,46.5 24.25,46.5 24.5,46.25 v24.5,44.75 24.75,44.75 25.25,44.25 25.25,43.6 C19.1 25.35,41.5 C20.1 | C26.1 23.53,46.47 23.5,46.5
IOVDD1
  Top 0.2: U1.1 17.15,45.35 15.5,47 15.5,50.4 C24.1 15.6,51.8 R10.1
IOVDD2
  Top 0.2: U1.2 18.03,45.97 17,47 17,50.4 C25.1 16.9,51.8 R9.1
LNA_EN  (via drill 0.4)
  Top 0.2: v13.75,44.5 14.5,44.5 15.4,43.6 U1.38 | U5.6 23.18,28.68 v23.5,29
  Bottom 0.2: v13.75,44.5 12.25,43 12.25,31.5 12.5,31.25 14.5,31.25 15,30.75 15,30 16,29 v23.5,29
MCLK  (via drill 0.4)
  Top 0.2: U7.1 42,39.25 41.25,38.5 28.75,38.5 v28.5,38.75 | 31.35,45.1 L9.1 v32.5,45
  Bottom 0.2: v28.5,38.75 28.5,44 29.5,45 v32.5,45
MISO  (via drill 0.4)
  Top 0.2: 42,53.94 J2.10 | 41.75,54 J2.10 | U1.6 20.03,48.78 v20.5,49.25 | U7.11 37.25,44 36.75,43.5 v35.25,43.5 34.75,44 34.75,46.25 34.25,46.75 v34.25,48.25 34.25,49.75 35.75,51.25 40.75,51.25 41.25,51.75 41.25,53.5 J2.10 | v36.25,37.75 36.25,35.5 35.75,35 35.19,35 U2.8 | SD1.7 32.13,64.88 v32.75,65.5
  Bottom 0.2: v20.5,49.25 33.25,49.25 v34.25,48.25 34.25,49.75 34.75,50.25 34.75,51.5 32.5,53.75 32.5,65.25 v32.75,65.5 | v35.25,43.5 35.25,38.75 v36.25,37.75 36.25,35.5 38.25,33.5 38.25,19.75 37.75,19.25 ISP.1
MOSI  (via drill 0.4)
  Top 0.2: 41.73,55.25 J2.8 41.69,55.25 40.75,55.25 40.5,55 40.5,52.25 40,51.75 35,51.75 v34,50.75 33.5,50.25 33.5,48 33.75,47.75 33.75,46.5 34.25,46 34.25,43 34.5,42.75 v36.5,42.75 37.25,43.5 U7.10 | U1.5 19.53,49.53 v20.5,50.5 | v41,36.25 41,35.19 U2.7 40.81,35 39.75,35 39,34.25 39,26.5 38.5,26 36.25,26 35.25,25 35.25,23 34.04,21.79 ISP.4 | SD1.3 27.73,64.73 v28.25,65.25
  Bottom 0.2: v20.5,50.5 33.75,50.5 v34,50.75 34,51.5 32,53.5 32,65.25 31.25,66 28.75,66 28.25,65.5 v28.25,65.25 | v36.5,42.75 36.5,38.75 37,38.25 37,36.75 37.5,36.25 v41,36.25
N$1
  Top 0.2: U1.21 22.03,39.22 22.5,38.75 22.5,38.25 23.25,37.5 26.55,37.5 X1.1 29.45,36.4 C29.1
N$2
  Top 0.2: U1.22 21.53,38.72 22,38.25 22,38 22.75,37.25 22.75,34.75 23.4,34.1 X1.3 23.65,33.9 C28.1
N$3
  Top 0.2: L14.1 25.75,46 25.25,45.5 24,45.5 23.1,44.6 U1.11
N$6  (via drill 0.6)
  Top 0.3: USB.1 16.23,73.5 | 16.23,73.5 16.23,71.52 v16.5,71.25 | C30.1 16.98,72.75 16.23,73.5
  Top 0.6: U4.3 8.44,25.94 6.5,24 1.25,24 0.75,24.5 0.75,58.25 v13.75,71.25
  Bottom 0.6: v13.75,71.25 v16.5,71.25
N$7
  Top 0.2: U5.15 16.57,28.68 15.75,29.5 15.25,29.5 15,29.75 15,30.35 R2.2
N$8
  Top 0.2: U5.7 25.11,28.04 R3.1
N$9
  Top 0.3: C11.2 18.75,2.36 J3.SIG
N$12
  Top 0.2: U7.24 42.62,47.23 43.15,47.75 C38.1
N$13
  Top 0.3: U5.11 19.64,25.25 L2.1
N$14
  Top 0.3: L2.2 18.75,21.1 C8.1 18.75,20.9 L3.1
N$15
  Top 0.3: L3.2 C9.1
N$16
  Top 0.3: C9.2 18.75,13.15 C10.1 L4.1 18.6,9.5 C11.1
N$18
  Top 0.2: U1.36 16.1,42.6 15.25,41.75 L5.1
N$19
  Top 0.2: U1.30 17.11,39.35 R7.2
N$20  (via drill 0.4)
  Top 0.2: U7.18 39,48 v39.15,48.25
  Bottom 0.2: C36.1 37.5,48.75 37.75,49 38.75,49 v39.15,48.25
N$21  (via drill 0.4)
  Top 0.2: U1.39 15.9,44.1 v15.5,44.5
  Bottom 0.2: C23.1 16.3,45.3 v15.5,44.5
N$22
  Top 0.2: U1.14 25.1,43.1 26,44 L10.2
N$23
  Top 0.2: U1.13 24.85,43.6 25.75,44.5 25.75,44.75 26,45 L9.2
N$24
  Top 0.2: U1.19 23.4,40.6 23.75,40.25 23.75,40 24.25,39.5 26.15,39.5 R11.1 26.4,39.75
N$25
  Top 0.2: U1.15 25.35,42.6 25.75,43 L11.2
N$26
  Top 0.2: U1.16 26.55,42.1 L12.2
N$27
  Top 0.2: U1.17 25.15,41.6 25.75,41 L13.2
N$28
  Top 0.2: U1.9 21.53,47.43 R12.1
N$29
  Top 0.2: R12.2 GIO3.A
N$30  (1 unrouted)
  Top 0.2: U1.7 20.53,48.03 21,48.5 22.5,48.5 22.75,48.75 22.75,49.75 23,50 23.79,50 SW1.4 23.89,50 24.5,50
N$31
  Top 0.2: R13.1 8.39,38.45 PWR.A
N$32  (via drill 0.4)
  Top 0.2: U7.29 v44.75,44.5
  Bottom 0.2: v44.75,44.5 45.35,44.5 C37.1
N$33  (via drill 0.4)
  Top 0.2: C40.1 35.25,49.5 36.25,50.5 42,50.5 v43.75,52.25
  Bottom 0.2: v43.75,52.25 45.25,53.75 45.25,72.75 IN.2
N$34
  Top 0.2: U7.14 37,45.5 36.75,45.75 36.75,46.9 C39.2
N$35
  Top 0.2: U7.13 35.75,45 35.25,45.5 C40.2
N$36  (via drill 0.4)
  Top 0.2: v40,49.25 37.4,49.25 C39.1
  Bottom 0.2: IN.4 43,69.4 43,51.5 42.5,51 41.25,51 40,49.75 v40,49.25
N$37
  Top 0.2: C42.2 47.75,51.75 48.25,51.25 48.25,6.5 46,4.25 38.2,4.25 OUT.2
N$38
  Top 0.2: C41.2 47.25,49.75 47.75,49.25 47.75,12.5 45,9.75 38.1,9.75 OUT.4
N$39
  Top 0.2: U7.22 41,48.5 41.5,49 43.75,49 44,49.25 44,51.25 44.5,51.75 C42.1
N$40
  Top 0.2: U7.23 41.5,48.25 41.75,48.5 44.25,48.5 44.5,48.75 44.5,49.1 C41.1
PA_EN  (via drill 0.4)
  Top 0.2: R6.2 v22.66,30.12 U5.5 | v14,43.25 14,43.1 L5.2
  Bottom 0.2: v22.66,30.12 22.66,29.91 22.25,29.5 16.25,29.5 15.75,30 15.75,30.75 14.75,31.75 13.25,31.75 13,32 13,42.25 v14,43.25
RESET_AVR
  Top 0.2: ISP.5 38.83,24.33 39.5,25 39.5,30.75 40,31.25 U2.4
RESET_CC8531  (via drill 0.4)
  Top 0.2: U7.31 43.25,43.5 44,42.75 | 44,42.75 45.75,42.75 46,43 46,52.5 45.5,53 v42,53 | 39.04,55.25 J2.7 38.77,55.25 v37,55.25 | L14.2 v30.5,46 | U2.6 42.79,33.79 43.5,34.5 43.5,42.25 44,42.75
  Bottom 0.2: 37,53 v37,55.25 | v42,53 37,53 | 37,53 36.25,52.25 36.25,47.25 35,46 v30.5,46
RF_N
  Top 0.2: U1.25 20.03,37.25 20.03,36.85 | 20.03,36.85 20.03,31.78 19.64,31.39 U5.2 | R1.1 20.03,36.85
RF_P
  Top 0.2: U1.24 20.53,36.85 | U5.4 20.95,31.3 20.53,31.72 20.53,36.75 20.53,36.85 | R1.2 20.53,36.85
SCLK  (via drill 0.4)
  Top 0.2: 41.8,56.5 J2.6 40.25,56.5 40,56.25 40,53 39.5,52.5 34,52.5 33,51.5 v33,51.25 33,47.75 33.25,47.5 33.25,46.25 33.75,45.75 33.75,42 v34.5,41.25 38,41.25 38.5,41.75 U7.8 | v18.5,49 19.03,48.47 U1.4 | v34.25,37.75 34.25,36.75 33.5,36 33.5,34.25 34,33.75 35.09,33.75 U2.9 | SD1.5 29.93,64.93 v30.25,65.25
  Bottom 0.2: v18.5,49 18.5,49.75 20,51.25 v33,51.25 33,51.75 31.5,53.25 31.5,64.5 30.75,65.25 v30.25,65.25 | v34.5,41.25 34.5,38 v34.25,37.75 35.5,36.5 35.5,35.5 37.75,33.25 37.75,22.5 37.04,21.79 ISP.3
WCLK  (via drill 0.4)
  Top 0.2: U7.3 41,40 40.5,39.5 31,39.5 v30.5,40 | 31.35,43.1 L11.1 v32.5,43
  Bottom 0.2: v30.5,40 30.5,42.15 L11.1 v32.5,43

### Text on the board
tDocu: AVDD_PA1 | 1.13mm | AVDD_LNA | 4.33mm | 1.49mm | AVDD_PA2